# Altium schematic sheet FTDI.SchDoc
size Letter; Author: Lihong; Chenwei; SheetNumber: 5; SheetTotal: 8
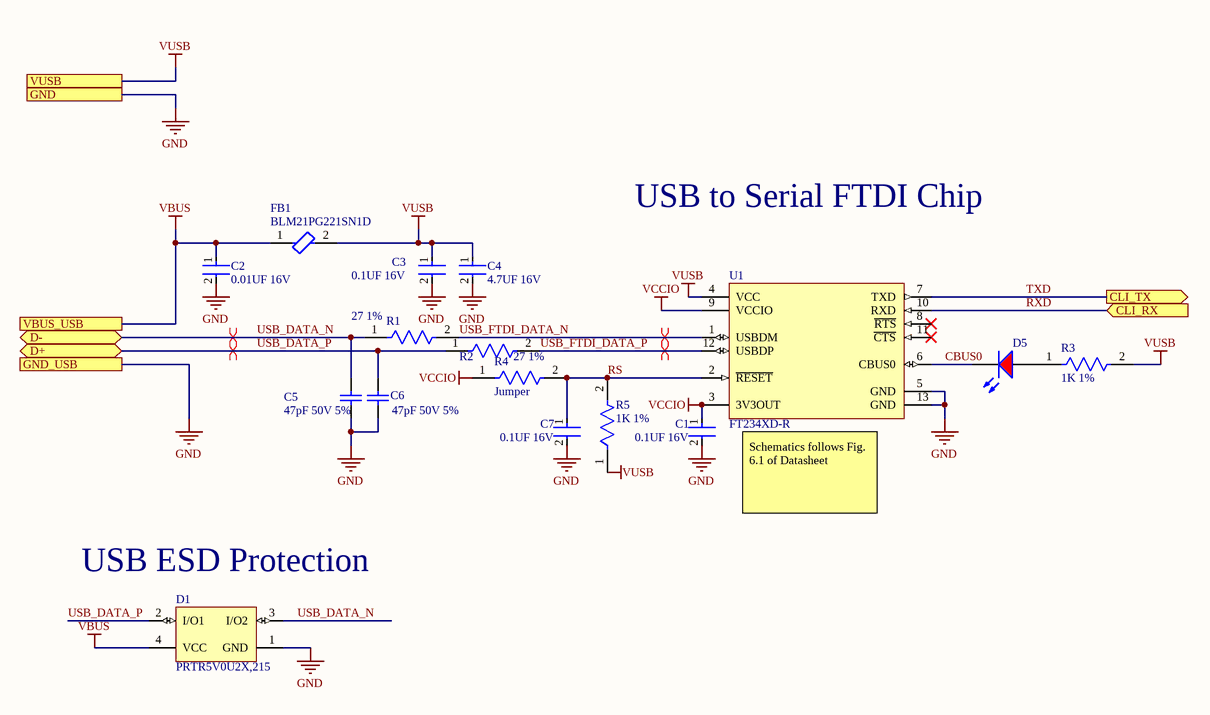
[diagram p0: FTDI.SchDoc]

## Parts
C1  0.1UF 16V  [FP-CC0402-MFG]
C2  0.01UF 16V  [FP-CC0402-MFG]
C3  0.1UF 16V  [FP-CC0402-MFG]
C4  4.7UF 16V  [FP-CC0402-MFG]
C5  47pF 50V 5%  [0603_CAP]
C6  47pF 50V 5%  [0603_CAP]
C7  0.1UF 16V  [FP-CC0402-MFG]
D1  PRTR5V0U2X,215  [NXP-SOT143B-4_V]
D5  LSM0805412V  [LED_0805_RED]  (value not drawn)
FB1  BLM21PG221SN1D  [FP-BLM21-0_2-t0_85-e0_5-IPC_B]
R1  27 1%  [FP-RMCF0603-IPC_B]
R2  27 1%  [FP-RMCF0603-IPC_B]
R3  1K 1%  [FP-RNCP0603-IPC_C]
R4  Jumper  [FP-RMCF0603-MFG]
R5  1K 1%  [FP-RNCP0603-IPC_C]
U1  FT234XD-R  [FP-DFN-12-MFG]

## Ports
CLI_RX (in), CLI_TX (out), D+ (bidir), D- (bidir), GND, GND_USB, VBUS_USB, VUSB

## Nets
GND: C1.2 C2.2 C3.2 C4.2 C5.1 C6.1 C7.2 D1.1(GND) U1.5(GND) U1.13(GND) ; port GND, port GND_USB
VBUS: C2.1 D1.4(VCC) FB1.1 ; port VBUS_USB
VCCIO: C1.1 R4.1 U1.3(3V3OUT) U1.9(VCCIO)
VUSB: C3.1 C4.1 FB1.2 R3.2 R5.1 U1.4(VCC) ; port VUSB
CBUS0: D5.K U1.6(CBUS0)
RS: C7.1 R4.2 R5.2 U1.2(~{RESET})
RXD: U1.10(RXD) ; port CLI_RX
TXD: U1.7(TXD) ; port CLI_TX
USB_DATA_N: C5.2 D1.3(I/O2) R1.1 ; port D-
USB_DATA_P: C6.2 D1.2(I/O1) R2.1 ; port D+
USB_FTDI_DATA_N: R1.2 U1.1(USBDM)
USB_FTDI_DATA_P: R2.2 U1.12(USBDP)
NetD5_A: D5.A R3.1

Not connected (* = marked no-connect by the designer): U1 8(~{RTS})* 11(~{CTS})*

## Layout directives
differential pair: USB_DATA_N, USB_DATA_P, USB_FTDI_DATA_N, USB_FTDI_DATA_P

## Notes on the sheet
- USB to Serial FTDI Chip
- Schematics follows Fig. 6.1 of Datasheet
- (near D1) USB ESD Protection
- Title:
- Desc:
- Size:
- Letter
- Auth:
- Proj:
- Sheet
- of
- www.seas.upenn.edu
- Electrical and Systems Engineering

## Library data of the parts
C1 C3 C7 = CMP-03422-000946-1: CC0402 100 nF X7R 10.00% 25 V; Manufacturer Part Number: CC0402KPX7R8BB104; Manufacturer: YAGEO; Capacitance: 100 nF; Material: Ceramic; Tolerance: 0.1; Value: 100 nF; Temperature Coefficient: 30ppm/°C; Automotive Grade: NA; Voltage Rating: 25 V; Footprint Url: http://www.yageo.com/exep/pages/download/literatures/UPY-C_GEN_24.pdf; ComponentLink2Description: Datasheet; Device Class L2: Capacitors; Device Class L3: Ceramic Capacitors; Height: 0.55mm; Ipc Land Pattern Name: CAPC10050X50; Category: Cap; ComponentLink2URL: http://www.yageo.com/documents/recent/UPY-GP_NP0_16V-to-50V_16.pdf; Automotive: No; Temperature: -55°C to +125°C; Lead Free: Yes; Temperature Range High: +125°C; Temperature Range Low: -55°C; Temperature Characteristic: X7R; Package: CC0402; RoHS: TRUE; Octopart: https://octopart.com/cc0402kpx7r8bb104-yageo-61757486; Device Class L1: Passive Components
C2 = CMP-03422-000420-1: CC0402 10 nF X7R 10.00% 16 V; Manufacturer: YAGEO; Manufacturer Part Number: CC0402KPX7R7BB103; Capacitance: 10 nF; Value: 10 nF; Tolerance: 0.1; Automotive Grade: NA; Temperature Coefficient: 30ppm/°C; Material: Ceramic; Automotive: No; Device Class L1: Passive Components; Temperature Range Low: -55°C; Ipc Land Pattern Name: CAPC10050X50; Temperature Characteristic: X7R; Voltage Rating: 16 V; Lead Free: Yes; Footprint Url: http://www.yageo.com/exep/pages/download/literatures/UPY-C_GEN_24.pdf; Octopart: https://octopart.com/cc0402kpx7r7bb103-yageo-12885102; RoHS: TRUE; Height: 0.55mm; Device Class L3: Ceramic Capacitors; Mouser Description: Multilayer Ceramic Capacitors MLCC - SMD/SMT 10nF 16V X7R 10%; Package: CC0402; ComponentLink2Description: Datasheet; Category: Cap; ComponentLink2URL: http://www.yageo.com/documents/recent/UPY-GP_NP0_16V-to-50V_16.pdf; Temperature: -55°C to +125°C; Temperature Range High: +125°C; Device Class L2: Capacitors
C4 = CMP-03422-000634-1: CAP CER 4700PF 25V X7R 0402; Manufacturer Part Number: CC0402KRX7R8BB472; Manufacturer: YAGEO; Material: Ceramic; Automotive Grade: NA; Value: 4.7 nF; Tolerance: 0.1; Temperature Coefficient: 30ppm/°C; ComponentLink2URL: http://www.yageo.com/documents/recent/UPY-GP_NP0_16V-to-50V_16.pdf; Digikey Description: CAP CER 4700PF 25V X7R 0402; RoHS: TRUE; Ipc Land Pattern Name: CAPC10050X50; Footprint Url: http://www.yageo.com/exep/pages/download/literatures/UPY-C_GEN_24.pdf; Voltage Rating: 25 V; Mouser Description: 0402 4.7 nF 25 V ±10 % Tolerance X7R SMT Multilayer Ceramic Capacitor; Device Class L3: Ceramic Capacitors; Device Class L1: Passive Components; ComponentLink2Description: Datasheet; Temperature Range Low: -55°C; Device Class L2: Capacitors; Category: Cap; Octopart: https://octopart.com/cc0402krx7r8bb472-yageo-40254851; Lead Free: Yes; Height: 0.55mm; Temperature: -55°C to +125°C; Automotive: No; Temperature Range High: +125°C; Capacitance: 4.7 nF; Package: CC0402; Temperature Characteristic: X7R
C5 C6 = CMP-011-000339-1: Capacitor Surface Mount 0603 Footprint 47PF 50V 5% Tolerance Ceramic C0G; Manufacturer P/N: CAP 0603 47PF 50V 5% C0G; Manufacturer: Various; Description in Visual: Cap SMT 0603 47PF 50V 5%  Cer C0G; PCB Package: 0603; Value: 47PF; Voltage: 50V; P/N: CAP 0603 47PF 50V 5% C0G; Mount: SMT; Tolerance: 5%; Type: Ceramic C0G
D1 = CMP-2000-05285-1: Ultra Low Capacitance Double Rail-to-Rail ESD Protection Diode, 5.5 V, 1 pF, -40 to 85 degC, 4-Pin SOT143B, RoHS, Tape and Reel; Manufacturer: NXP Semiconductors; Capacitance Value: 16pF; Number of Elements: 1; Rad Hardened: No; Reverse Breakdown Voltage: 6V; Working Voltage (Max): 5.5V; Polarity: Uni-Directional; Configuration: Quad; Leakage Current: 0.1uA; Product Height (mm): 1mm; Suppressor Type: DiodeArrays; Product Length (mm): 3mm; Product Depth (mm): 1.4mm; ESD Protection Voltage: 8KV@ContactDisc; Package Type: SOT; Mounting: SurfaceMount; Packaging: TapeandReel; Datasheet Version: Rev. 02, 01/2008; Reverse Stand-off Voltage: 5.5V; Manufacturer URL: http://www.nxp.com/; Operating Temp Range: -40Cto85C; Operating Temperature Classification: Industrial; Working Voltage: 5.5V; Operating Temperature Min Deg. C: -40C; Datasheet URL: https://datasheet.ciiva.com/4479/prtr5v0u2x-102853-4479461.pdf; Leakage Current (Max): 0.1uA; Direction Type: Uni-Directional; Pin Count: 3+Tab; Operating Temperature Max Deg. C: 85C; Mounting Style: SurfaceMount; Package / Case: SOT
D5 = CMP-00026-00001-1: Single Color LED, RED, 0805; Test Current: 20mA; Forward Voltage: 2V; RoHS Compliant: Yes
FB1 = CMP-0686-00610-3: Chip Ferrite Bead, 0805, 220Ω @ 100MHz, 0.045Ω, 25%, 2A; Number of Circuits: 1; Shielding: Unshielded; DC Resistance (DCR): 45mR; Impedance: 220R; Radiation Hardening: No; Material: Ferrite; Frequency: 100MHz; Width: 1.25mm; DC Current: 2A; Max DC Current: 2A; Number of Lines: 1; Package Quantity: 1; Case Code (Metric): 2012; Current Rating: 2A; Case/Package: 0805; Current: 2A; Military Standard: Not; Core Material: Ferrite; Depth: 1.25mm; Contact Plating: Tin; DC Resistance-Max: 45mR; Max Operating Temperature: 125°C; Length: 2mm; Max Current Rating: 2A; REACH SVHC: No SVHC; Termination: SMD/SMT; Min Operating Temperature: -55°C; Series: BLM21P; Test Frequency: 100MHz; Tolerance: 25%; Number of Pins: 2; RoHS Compliant: Yes; Height: 0.85mm; Packaging: Tape and Reel; Lead Free: Lead Free; Case Code (Imperial): 0805
R1 R2 = CMP-26527-005743-1: 27Ω ±1% 0.1W 0603 Thick Film Chip Resistor AEC-Q200 compliant; Max Power Dissipation: 100mW; Resistance: 27R; Temperature Coefficient: 100ppm/°C; Case/Package: 0603; Contact Plating: Tin; Packaging: Tape and Reel; Length: 0.061inch; Radiation Hardening: No; Mount: Surface Mount; Series: RMCF; Min Operating Temperature: -55°C; Lead Free: Lead Free; Width: 0.031inch; Resistor Type: Thick Film; Max Operating Temperature: 155°C; RoHS Compliant: Yes; Case Code (Imperial): 0603; Height: 0.022inch; Number of Terminations: 2; Case Code (Metric): 1608; Tolerance: 1%; Features: Automotive AEC-Q200
R3 R5 = CMP-26527-006179-1: 1kΩ ±1% 0.125W 0603 High Power Anti-Sulfur Thin Film Chip Resistor; Temperature Coefficient: 100ppm/°C; Max Power Dissipation: 125mW; Resistance: 1kR; Case/Package: 0603; Width: 0.031inch; Tolerance: 1%; Case Code (Imperial): 0603; RoHS Compliant: Yes; Min Operating Temperature: -55°C; Resistor Type: Thin Film; Features: Moisture Resistant; Length: 0.059inch; Mount: Surface Mount; Case Code (Metric): 1608; Height: 0.02inch; Max Operating Temperature: 155°C; Packaging: Tape and Reel; Series: RNCP; Number of Terminations: 2
R4 = CMP-26527-000011-1: RES 0 OHM JUMPER 1/10W 0603; Manufacturer Part Number: RMCF0603ZT0R00; Manufacturer: Stackpole; Power Rating: 0.1W; Voltage Rating: 75V; Resistance: 0mΩ; Automotive Grade: Grade 0; Value: 0mΩ; Series: RMCF; Device Class L1: Passive Components; Device Class L3: Chip SMD Resistors; Octopart: https://octopart.com/rmcf0603zt0r00-stackpole+electronics-19213618; Temperature: -55°C to +155°C; Lead Free: Yes; ComponentLink2URL: https://www.seielect.com/catalog/sei-rmcf_rmcp.pdf; Height: 0.55mm; Composition: Thick Film; Package: RMCF0603; Automotive: Yes; Temperature Range High: +155°C; Ipc Land Pattern Name: RESC15580X45; Digikey Description: RES 0 OHM JUMPER 1/10W 0603; RoHS: TRUE; ComponentLink2Description: Datasheet; Temperature Range Low: -55°C; Category: Res; Device Class L2: Resistors
U1 = CMP-00104-3: USB Bridge, USB to UART USB 2.0 UART Interface 12-DFN (3x3); Power Supplies: 1.8/3.3,3.3/5V; Min Supply Voltage: 2.97V; Time @ Peak Reflow Temperature-Max (s): 40s; Package Body Material: Plastic; Nominal Supply Voltage: 5V; Max Supply Voltage: 5.5V; Qualification Status: Not Qualified; Length: 3mm; Surface Mount: Yes; Moisture Sensitivity Level: 3; Min Operating Temperature: -40°C; Width: 3mm; Terminal Pitch: 0.45mm; Terminal Position: DUAL; RoHS Compliant: Yes; Terminal Form: No Lead; Technology: CMOS; Reach SVHC Compliant: Yes; Case/Package: HTSON; Peak Reflow Temperature (Cel): 260°C; Package Shape: Square; Pins: 12; Temperature Grade: INDUSTRIAL; Package Style: SMALL OUTLINE, HEAT SINK/SLUG, THIN PROFILEMeter; Max Operating Temperature: 85°C